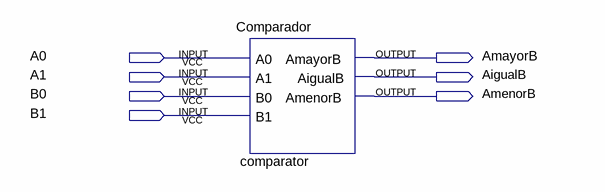
[diagram p0: schematic sheet]
// Quartus schematic Pract2.bdf as structural Verilog: 1 symbols, 7 pins
module Pract2 (
  input  A0,
  input  A1,
  input  B0,
  input  B1,
  output AmayorB,
  output AigualB,
  output AmenorB
);

  Comparador comparator (.A0(A0), .A1(A1), .B0(B0), .B1(B1), .AmayorB(AmayorB), .AigualB(AigualB), .AmenorB(AmenorB));
endmodule
